# EAGLE design esp8266Board (EAGLE 8.7.0)
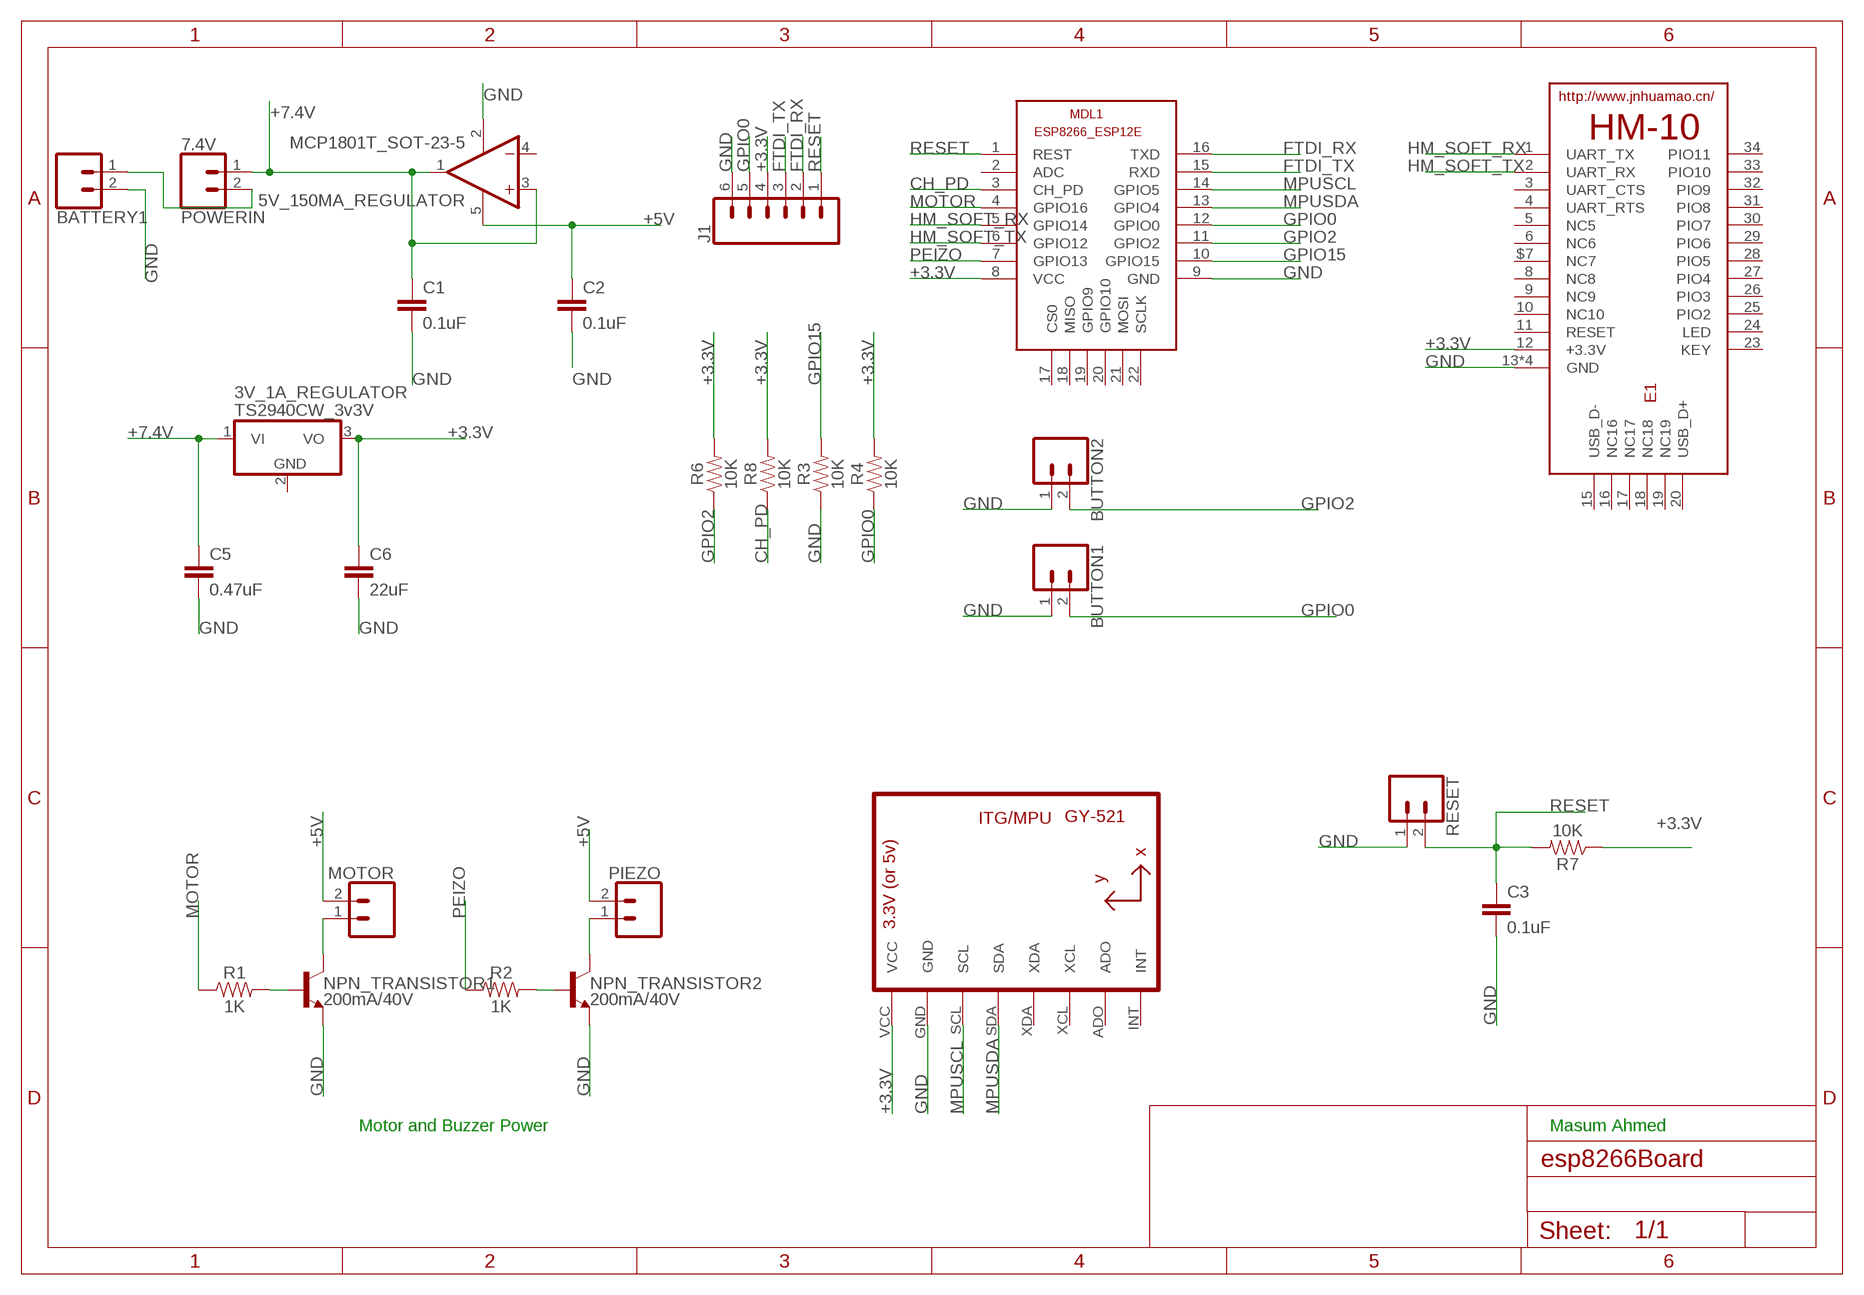
[diagram p0: schematic, sheet 1]

## Parts
3V_1A_REGULATOR  TS2940CW_3v3V  MCP1703DB  [SOT223]
5V_150MA_REGULATOR  MCP1801T_SOT-23-5  MCP601OT  [SOT23-5]
BATTERY1  CONN_02  [1X02]
BUTTON1  CONN_02  [1X02]
BUTTON2  CONN_02  [1X02]
C1  0.1uF  1.0UF-0805-25V-10%  [0805]
C2  0.1uF  1.0UF-0805-25V-10%  [0805]
C3  0.1uF  1.0UF-0805-25V-10%  [0805]
C5  0.47uF  0.1UF-KIT-EZ-50V-20%  [CAP-PTH-SMALL-KIT]
C6  22uF  0.1UF-KIT-EZ-50V-20%  [CAP-PTH-SMALL-KIT]
E1  HM-10-BOARD  [26.9X13X2.2_BOARD]
J1  CONN_06SILK_FEMALE_PTH  [1X06]
MDL1  ESP8266-12EESP8266-ESP12E  [ESP8266-ESP12E]
MOTOR  CONN_02  [1X02]
NPN_TRANSISTOR1  200mA/40V  TRANS_NPN-2N3904  [TO-92]
NPN_TRANSISTOR2  200mA/40V  TRANS_NPN-2N3904  [TO-92]
PIEZO  CONN_02  [1X02]
POWERIN  7.4V  CONN_02  [1X02]
R1  1K  0.22OHM-0805-1/4W-1%  [0805]
R2  1K  0.22OHM-0805-1/4W-1%  [0805]
R3  10K  0.22OHM-0805-1/4W-1%  [0805]
R4  10K  0.22OHM-0805-1/4W-1%  [0805]
R6  10K  0.22OHM-0805-1/4W-1%  [0805]
R7  10K  0.22OHM-0805-1/4W-1%  [0805]
R8  10K  0.22OHM-0805-1/4W-1%  [0805]
RESET  CONN_02  [1X02]
U1  GY-521MPU6050  [GY-521]

## Nets
+3.3V: 3V_1A_REGULATOR.3(VO) C6.1 E1.12(+3.3V) J1.4 MDL1.8(VCC) R4.2 R6.2 R7.1 R8.2 U1.VCC
+5V: 5V_150MA_REGULATOR.5(V+) C2.1 MOTOR.2 PIEZO.2
+7.4V: 3V_1A_REGULATOR.1(VI) 5V_150MA_REGULATOR.1(OUT) 5V_150MA_REGULATOR.3(+IN) C1.1 C5.1 POWERIN.1
CH_PD: MDL1.3(CH_PD) R8.1
FTDI_RX: J1.2 MDL1.16(TXD)
FTDI_TX: J1.3 MDL1.15(RXD)
GND: 5V_150MA_REGULATOR.2(V-) BATTERY1.2 BUTTON1.1 BUTTON2.1 C1.2 C2.2 C3.2 C5.2 C6.2 E1.13(GND) E1.14(GND) E1.21(GND) E1.22(GND) J1.6 MDL1.9(GND) NPN_TRANSISTOR1.1(E) NPN_TRANSISTOR2.1(E) R3.1 RESET.1 U1.GND
GPIO0: BUTTON1.2 J1.5 MDL1.12(GPIO0) R4.1
GPIO2: BUTTON2.2 MDL1.11(GPIO2) R6.1
GPIO15: MDL1.10(GPIO15) R3.2
HM_SOFT_RX: E1.1(UART_TX) MDL1.5(GPIO14)
HM_SOFT_TX: E1.2(UART_RX) MDL1.6(GPIO12)
MOTOR: MDL1.4(GPIO16) R1.1
MPUSCL: MDL1.14(GPIO5) U1.SCL
MPUSDA: MDL1.13(GPIO4) U1.SDA
N$1: BATTERY1.1 POWERIN.2
N$4: NPN_TRANSISTOR2.2(B) R2.2
N$5: NPN_TRANSISTOR1.2(B) R1.2
N$6: NPN_TRANSISTOR2.3(C) PIEZO.1
N$9: MOTOR.1 NPN_TRANSISTOR1.3(C)
PEIZO: MDL1.7(GPIO13) R2.1
RESET: C3.1 J1.1 MDL1.1(REST) R7.2 RESET.2
Unconnected: 3V_1A_REGULATOR.2(GND) 5V_150MA_REGULATOR.4(-IN) E1.3(UART_CTS) E1.4(UART_RTS) E1.5(NC5) E1.6(NC6) E1.8(NC8) E1.9(NC9) E1.10(NC10) E1.11(RESET) E1.15(USB_D-) E1.16(NC16) E1.17(NC17) E1.18(NC18) E1.19(NC19) E1.20(USB_D+) E1.23(KEY) E1.24(LED) E1.25(PIO2) E1.26(PIO3) E1.27(PIO4) E1.28(PIO5) E1.29(PIO6) E1.30(PIO7) E1.31(PIO8) E1.32(PIO9) E1.33(PIO10) E1.34(PIO11) E1.$7(NC7) MDL1.2(ADC) MDL1.17(CS0) MDL1.18(MISO) MDL1.19(GPIO9) MDL1.20(GPIO10) MDL1.21(MOSI) MDL1.22(SCLK) U1.ADO U1.INT U1.XCL U1.XDA

## Notes on the sheet
- Motor and Buzzer Power | Masum Ahmed

## Library data of the parts
3V_1A_REGULATOR = linear:MCP1703: 250 mA, 16V, Low Quiescent Current LDO Regulator Source: http://ww1.microchip.com/downloads/en/DeviceDoc/22049b.pdf
5V_150MA_REGULATOR = linear:MCP601: Single Op Amp 2.7V to 6.0V Single Supply CMOS Source: http://ww1.microchip.com/downloads/en/DeviceDoc/21314g.pdf
BATTERY1 BUTTON1 BUTTON2 MOTOR PIEZO POWERIN RESET = SparkFun-Connectors:CONN_02: Multi connection point. Often used as Generic Header-pin footprint for 0.1 inch spaced/style header connections On any of the 0.1 inch spaced packages, you can populate with these: Break Away Headers - Straight <https://www.sparkfun.com/products/116> (PRT-00116) Break Away Male Headers - Right Angle <https://www.sparkfun.com/products/553> (PRT-00553) Female Headers <https://www.sparkfun.com/products/115> (PRT-00115) Break Away Headers - Machine Pin <https://www.sparkfun.com/products/117> (PRT-00117) Break Away Female Headers - Swiss Machine Pin <https://www.sparkfun.com/products/743> (PRT-00743) For SCREWTERMINALS and SPRING TERMINALS visit here: Screw Terimnals on SparkFun.com <https://www.sparkfun.com/search/results?term=Screw+Terminals> (5mm/3.5mm/2.54mm spacing) This device is also useful as a general connection point to wire up your design to another part of your project. Our various solder wires solder well into these plated through hole pads. Hook-Up Wire - Assortment (Stranded, 22 AWG) <https://www.sparkfun.com/products/11375> (PRT-11375) Hook-Up Wire - Assortment (Solid Core, 22 AWG) <https://www.sparkfun.com/products/11367> (PRT-11367) View the entire wire category on our website here <https://www.sparkfun.com/categories/141> Special notes: Molex polarized connector foot print use with: PRT-08233 with associated crimp pins and housings. 2.54_SCREWTERM for use with PRT-10571. 3.5mm Screw Terminal footprints for PRT-08084 5mm Screw Terminal footprints for use with PRT-08432
C1-C3 = Capacitors:1.0UF: 1�F ceramic capacitors A capacitor is a passive two-terminal electrical component used to store electrical energy temporarily in an electric field.; PROD_ID: CAP-08064; VALUE: 1.0uF
C5 C6 = SparkFun-Capacitors:0.1UF: 0.1µF ceramic capacitors A capacitor is a passive two-terminal electrical component used to store electrical energy temporarily in an electric field.; PROD_ID: CAP-08370; VALUE: 0.1uF
E1 = hm10:HM-10: HM Bluetooth module use TI CC2540 or CC2541, Master and slave roles in one, transmission version and remote control version and PIO state acquisition functions in one, Support the AT command modify module parameters, Convenient and flexible.
J1 = SparkFun-Connectors:CONN_06: Multi connection point. Often used as Generic Header-pin footprint for 0.1 inch spaced/style header connections On any of the 0.1 inch spaced packages, you can populate with these: Break Away Headers - Straight <https://www.sparkfun.com/products/116> (PRT-00116) Break Away Male Headers - Right Angle <https://www.sparkfun.com/products/553> (PRT-00553) Female Headers <https://www.sparkfun.com/products/115> (PRT-00115) Break Away Headers - Machine Pin <https://www.sparkfun.com/products/117> (PRT-00117) Break Away Female Headers - Swiss Machine Pin <https://www.sparkfun.com/products/743> (PRT-00743) Arduino Stackable Header - 6 Pin <https://www.sparkfun.com/products/9280> (PRT-09280) For SCREWTERMINALS and SPRING TERMINALS visit here: Screw Terimnals on SparkFun.com <https://www.sparkfun.com/search/results?term=Screw+Terminals> (5mm/3.5mm/2.54mm spacing) This device is also useful as a general connection point to wire up your design to another part of your project. Our various solder wires solder well into these plated through hole pads. Hook-Up Wire - Assortment (Stranded, 22 AWG) <https://www.sparkfun.com/products/11375> (PRT-11375) Hook-Up Wire - Assortment (Solid Core, 22 AWG) <https://www.sparkfun.com/products/11367> (PRT-11367) View the entire wire category on our website here <https://www.sparkfun.com/categories/141>; PROD_ID: CONN-08437
MDL1 = esp826612e:ESP8266-12E: ESP8266-12E with additional I/O and GPIO04/05 corrected The author cannot warrant that this library is free from error or will meet your specific requirements. Created by PuceBaboon.com. Komagane, Nagano, JAPAN
NPN_TRANSISTOR1 NPN_TRANSISTOR2 = SparkFun-DiscreteSemi:TRANS_NPN: NPN transistor Current controlled devices typically used to amplify current or used as a switch. BC547 - COM-08928 <http://www.sparkfun.com/products/8928> (TO-92 45V 100mA) (1.Collector 2.Base 3.Emitter) 2N3904 - COM-00521 <http://www.sparkfun.com/products/521> (TO-92 40V 200mA) (1.Emitter 2.Base 3.Collector) P2N2222A - COM-12852 <http://www.sparkfun.com/products/12852> (TO-92 40V 600mA) (1.Collector 2.Base 3.Emitter); PROD_ID: TRANS-08447
R1-R4 R6-R8 = SparkFun-Resistors:0.22OHM: 0.22Ω resistor A resistor is a passive two-terminal electrical component that implements electrical resistance as a circuit element. Resistors act to reduce current flow, and, at the same time, act to lower voltage levels within circuits. - Wikipedia; PROD_ID: RES-09883; VALUE: 0.22
U1 = mpu6050:GY-521

## Board
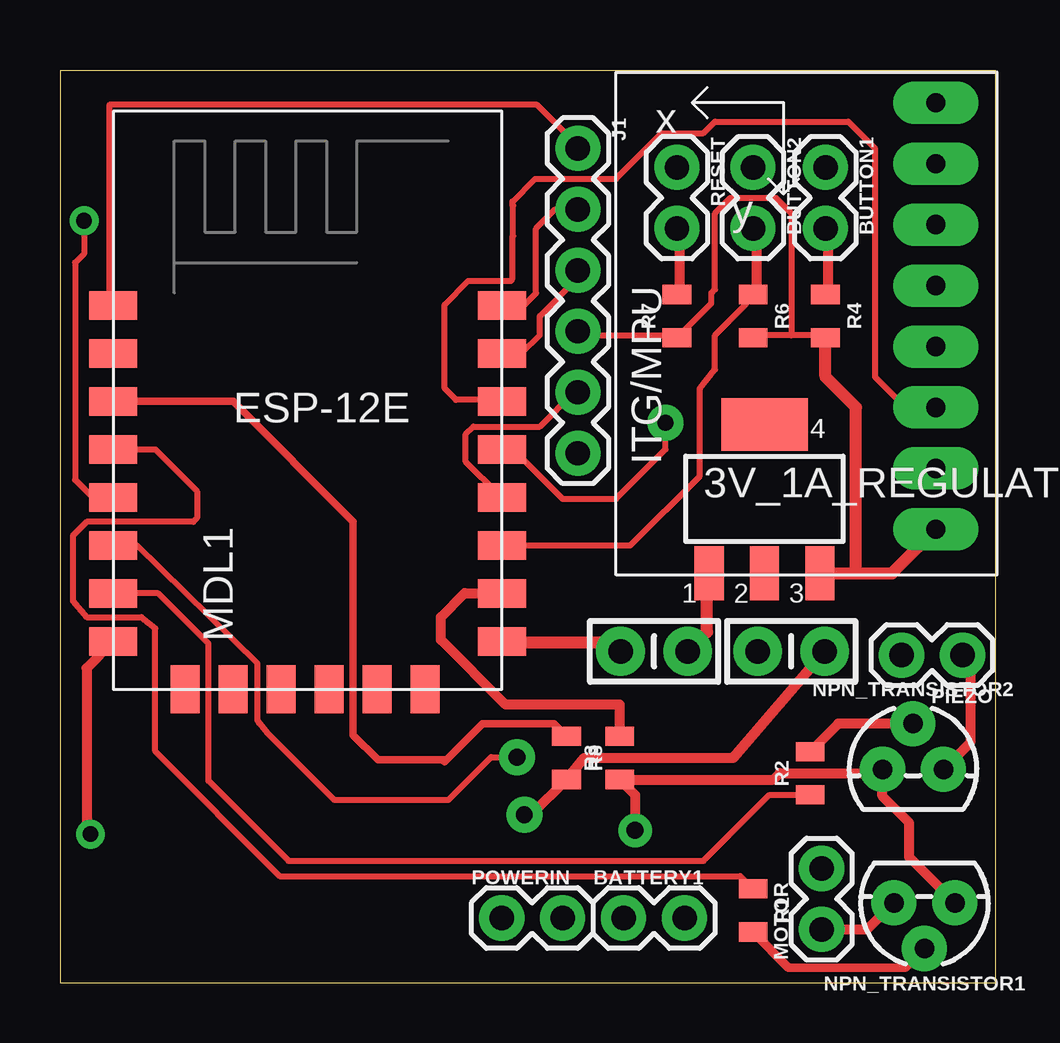
[diagram p1: board, top side]
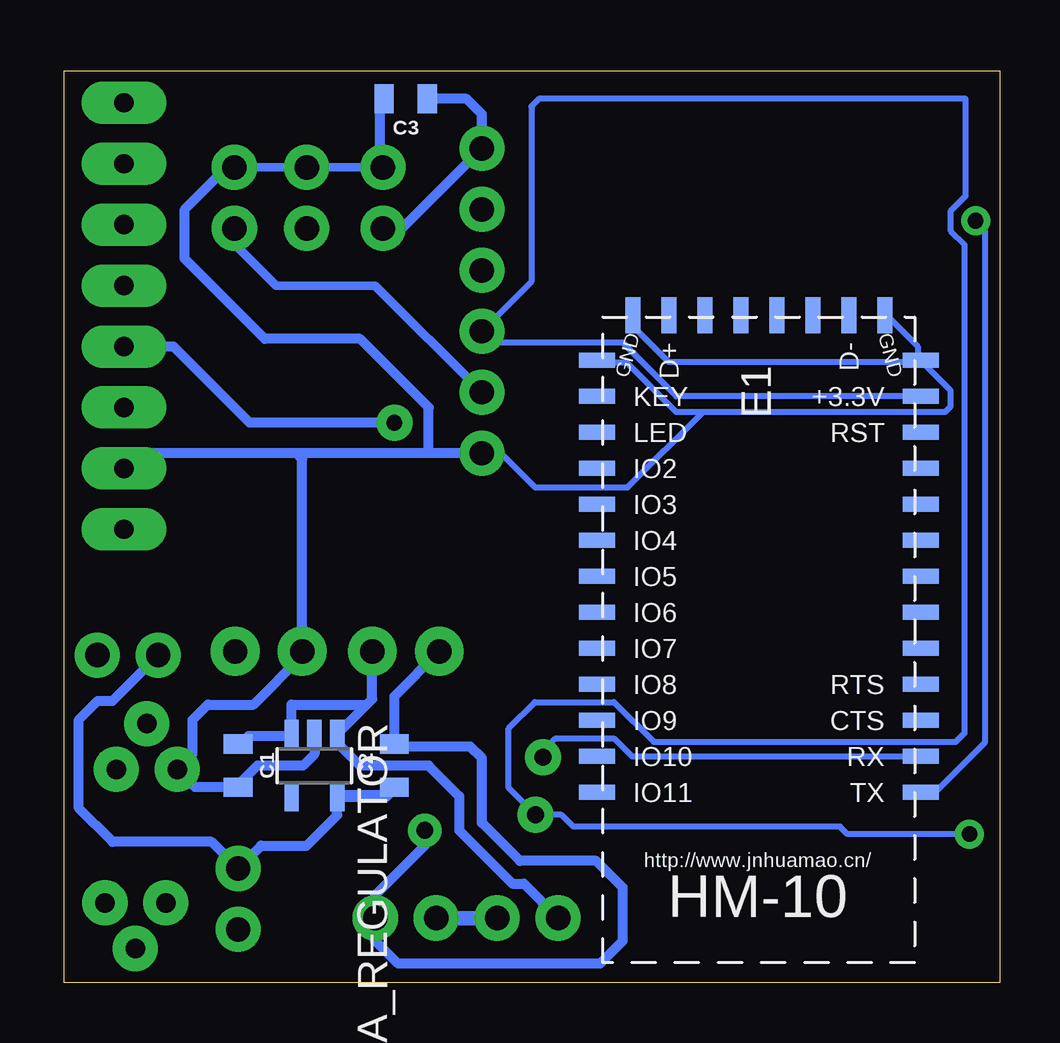
[diagram p2: board, bottom side, seen from below]

Size 39 x 38 mm. Coordinates in mm from the lower left corner, seen from the top.
Outline: 0,0 39,0 39,38 0,38 0,0
Copper layers (1*16): Top 0.035mm / dielectric 1.5mm / Bottom 0.035mm
Design rules "watch PCB rules *": minimum track width 10mil, minimum drill 0.5mm, track to track 8mil, track to pad 6mil, pad to pad 8mil, via to via 12mil, smd to smd 8mil, copper to edge 16mil, drill to drill 6mil, minimum pad ring 10mil, minimum via ring 8mil, stop-mask expansion 4mil, vias tented up to drill 0mil, thermal gap 12mil
vRestrict: area 1.1,12.1 to 19.5,30.8; area 2.4,0.3 to 17.8,12.2

### Footprints (pad centres in the part's own frame; a part is rotated, then mirrored left to right if it is on the bottom)
SOT223 = smd 1.219 x 2.235: 1 -2.311,-3.099; 2 0,-3.099; 3 2.311,-3.099 | smd 3.6 x 2.2: 4 0,3.099
SOT23-5 = smd 0.6 x 1.2: 1 -0.95,-1.306; 2 0,-1.306; 3 0.95,-1.306; 4 0.95,1.306; 5 -0.95,1.306
1X02 = drill 1.016 pad 1.88: 1 0,0; 2 2.54,0
0805 = smd 0.8 x 1.2: 1 -0.9,0; 2 0.9,0
CAP-PTH-SMALL-KIT = drill 1.016 pad 2.032: 1 -1.397,0; 2 1.397,0
26.9X13X2.2_BOARD = smd 1.5 x 0.635: 1 -7.5,0; 2 -7.5,-1.5; 3 -7.5,-3; 4 -7.5,-4.5; 5 -7.5,-6; 6 -7.5,-7.5; 8 -7.5,-10.5; 9 -7.5,-12; 10 -7.5,-13.5; 11 -7.5,-15; 12 -7.5,-16.5; 13 -7.5,-18; 22 6,-18; 23 6,-16.5; 24 6,-15; 25 6,-13.5; 26 6,-12; 27 6,-10.5; 28 6,-9; 29 6,-7.5; 30 6,-6; 31 6,-4.5; 32 6,-3; 33 6,-1.5; 34 6,0; $7 -7.5,-9 | smd 0.635 x 1.5: 14 -6,-19.875; 15 -4.5,-19.875; 16 -3,-19.875; 17 -1.5,-19.875; 18 0,-19.875; 19 1.5,-19.875; 20 3,-19.875; 21 4.5,-19.875
1X06 = drill 1.016 pad 1.88: 1 0,0; 2 2.54,0; 3 5.08,0; 4 7.62,0; 5 10.16,0; 6 12.7,0
ESP8266-ESP12E = smd 2 x 1.2: 1 -7.62,5.84; 2 -7.62,3.84; 3 -7.62,1.84; 4 -7.62,-0.16; 5 -7.62,-2.16; 6 -7.62,-4.16; 7 -7.62,-6.16; 8 -7.62,-8.16; 9 8.58,-8.16; 10 8.58,-6.16; 11 8.58,-4.16; 12 8.58,-2.16; 13 8.58,-0.16; 14 8.58,1.84; 15 8.58,3.84; 16 8.58,5.84 | smd 1.2 x 2: 17 -4.62,-10.16; 18 -2.62,-10.16; 19 -0.62,-10.16; 20 1.38,-10.16; 21 3.38,-10.16; 22 5.38,-10.16
TO-92 = drill 0.813 pad 1.88: 1 -1.27,0; 2 0,1.905; 3 1.27,0
GY-521 = drill 0.8 pad 1.778 long: ADO -8.89,-6.35; GND -8.89,6.35; INT -8.89,-8.89; SCL -8.89,3.81; SDA -8.89,1.27; VCC -8.89,8.89; XCL -8.89,-3.81; XDA -8.89,-1.27

### Placement (x,y rotation side)
3V_1A_REGULATOR  29.37,20.16 0 top
5V_150MA_REGULATOR  28.57,9.05 180 bottom
BATTERY1  23.5,2.7 0 top
BUTTON1  31.91,33.97 270 top
BUTTON2  28.89,33.97 270 top
C1  31.75,9.05 270 bottom
C2  25.24,9.05 90 bottom
C3  24.77,36.83 180 bottom
C5  24.77,13.81 180 top
C6  30.48,13.81 180 top
E1  10.79,7.94 180 bottom
J1  21.59,34.77 270 top
MDL1  9.84,22.38 0 top
MOTOR  31.75,2.22 90 top
NPN_TRANSISTOR1  36.04,3.33 180 top
NPN_TRANSISTOR2  35.56,8.89 0 top
PIEZO  37.62,13.65 180 top
POWERIN  18.41,2.7 0 top
R1  28.89,3.02 270 top
R2  31.27,8.73 90 top
R3  23.34,9.37 90 top
R4  31.91,27.78 270 top
R6  28.89,27.78 270 top
R7  25.72,27.78 90 top
R8  21.11,9.37 270 top
RESET  25.72,33.97 270 top
U1  27.62,27.78 180 top

### Tracks (layer width: path | path; a pad name or v marks a point on that pad's centre or on a via)
+3.3V  (via drill 0.65 pad 1.2, 0.7 pad 1.5)
  Top 0.254: J1.4 21.72,26.98 25.6,26.98 R7.1 27.15,28.31 27.15,28.73 27.3,28.89 27.3,32.07 27.94,32.7 29.84,32.7 30.48,32.07 30.48,26.98 | 30.48,26.98 31.77,26.98 R4.2 31.77,26.75 | 30.48,26.98 29.03,26.98 R6.2 | 31.77,17.14 3V_1A_REGULATOR.3 | 36.35,18.97 U1.VCC
  Top 0.406: C6.1 28.07,9.37 21.86,9.37 R8.2 19.64,7 v19.36,7 | MDL1.8 1.11,13.11 1.11,6.35 v1.27,6.19
  Top 0.508: 3V_1A_REGULATOR.3 33.18,17.06 | 33.18,17.06 34.68,17.06 U1.VCC | 33.18,17.06 33.18,23.97 31.91,25.24 R4.2
  Bottom 0.254: E1.12 13.48,24.44 15.72,26.67 21.11,26.67 J1.4 19.53,29.21 19.53,36.51 19.21,36.83 1.43,36.83 1.43,32.79 2.04,32.18 2.04,31.32 1.46,30.75 1.46,10.41 1.84,10.03 14.43,10.03 16.09,11.69 19.38,11.69 20.48,10.6 20.48,8.12 v19.36,7 18.27,7 17.78,6.51 6.67,6.51 6.35,6.19 v1.27,6.19
+5V
  Bottom 0.254: 27.43,7.77 5V_150MA_REGULATOR.5 | 25.38,8 C2.1
  Bottom 0.406: 5V_150MA_REGULATOR.5 27.62,6.98 28.89,5.71 30.8,5.71 MOTOR.2 32.86,5.87 36.99,5.87 38.39,7.28 38.39,10.95 37.6,11.75 36.99,11.75 PIEZO.2
  Bottom 0.508: 27.43,7.77 25.6,7.77 25.38,8
+7.4V
  Top 0.254: 26.98,16.92 3V_1A_REGULATOR.1
  Top 0.508: C5.1 26.98,14.62 26.98,16.92
  Bottom 0.254: 29.72,10.29 5V_150MA_REGULATOR.3 29.49,10.52 29.49,10.74 | 31.55,10.06 C1.1 | 27.43,10.52 5V_150MA_REGULATOR.1 | 27.43,10.29 5V_150MA_REGULATOR.1 | 27.62,10 5V_150MA_REGULATOR.1
  Bottom 0.406: 29.72,10.29 31.32,10.29 31.55,10.06 | 5V_150MA_REGULATOR.1 26.39,11.59 | C5.1 26.16,11.82 26.39,11.59 | 5V_150MA_REGULATOR.3 29.52,11.59 29.53,11.59 26.39,11.59 | 27.62,10 26.67,9.05 23.81,9.05 22.54,7.78 22.54,6.35 20.32,4.13 19.84,4.13 POWERIN.1
CH_PD
  Top 0.254: MDL1.3 2.29,24.23
  Top 0.305: R8.1 20.59,10.79 17.62,10.79 16.11,9.29 | 16.11,9.29 16.03,9.21 | 16.11,9.29 13.26,9.29 12.22,10.32 12.22,19.21 7.21,24.22 MDL1.3
FTDI_RX
  Top 0.254: MDL1.16 18.46,28.26 19.37,28.26 19.84,28.73 19.84,31.43 20.64,32.23 J1.2
FTDI_TX
  Top 0.254: 18.52,26.29 MDL1.15 19.24,26.22 20,26.99 20,27.78 21.59,29.37 J1.3
GND  (via drill 0.7 pad 1.4)
  Top 0.254: 36.35,21.49 U1.GND | 32,33.83 BUTTON1.1 | 18.52,14.17 MDL1.9
  Top 0.406: v23.97,6.35 23.97,7.83 R3.1 29.74,8.47 30,8.73 34.29,8.73 | NPN_TRANSISTOR1.1 35.4,5.24 35.4,6.67 34.29,7.78 34.29,8.73 | 34.29,8.73 NPN_TRANSISTOR2.1
  Top 0.508: C5.2 23.01,14.17 18.52,14.17
  Bottom 0.254: 25.83,34.06 RESET.1 | 35.89,21.95 36.35,21.49 U1.GND | 21.72,21.95 J1.6 20.8,22.07 19.37,20.64 15.52,20.64 12.38,23.77 | E1.13 3.43,26.06 3.43,26.52 4.57,27.66 E1.14 4.8,27.66 | 12.38,23.77 2.29,23.77 2.06,24 2.06,24.69 3.2,25.83 E1.13 | 12.38,23.77 13.49,23.77 15.54,25.83 16.69,25.83 E1.22 | 31.77,8.23 C1.2 | 29.21,21.95 29.33,22.07 29.53,22.07 | 25.14,9.84 C2.2 | E1.21 15.29,27.36 13.81,25.88 3.36,25.88 E1.13
  Bottom 0.356: 32.23,33.97 BUTTON1.1 BUTTON2.1 RESET.1
  Bottom 0.406: 25.83,34.06 25.83,36.58 C3.2 | C2.2 25.24,11.94 C5.2 | C1.2 33.55,8.15 NPN_TRANSISTOR2.1 33.66,9.53 33.66,10.95 33.02,11.59 31.11,11.59 29.08,13.62 C6.2 29.08,21.82 29.21,21.95 | J1.6 23.81,22.07 | 23.81,22.07 29.53,22.07 35.88,22.07 U1.GND | 23.81,22.07 23.81,23.97 26.67,26.83 30.64,26.83 33.97,30.16 33.97,32.23 32.23,33.97 | 25.14,9.84 22.07,9.84 21.59,9.37 21.59,6.67 20,5.08 16.83,5.08 15.72,3.97 15.72,1.75 16.67,0.79 25.08,0.79 26.04,1.75 BATTERY1.2 26.04,3.65 23.97,5.71 v23.97,6.35 | 5V_150MA_REGULATOR.2 28.57,9.53 29.05,9.05 30.96,9.05 31.77,8.23
GPIO0
  Top 0.254: 32,28.8 R4.1 | 32,31.32 BUTTON1.2 | MDL1.12 18.29,20.34 16.92,21.72 16.92,22.86 17.23,23.18 20,23.18 21.43,24.61 J1.5
  Top 0.406: 32,31.32 32,28.8
  Bottom 0.254: 31.77,31.32 BUTTON1.2 31.91,31.27 | 21.72,24.69 J1.5
  Bottom 0.356: J1.5 26.04,29.05 30.16,29.05 31.91,30.8 31.91,31.27
GPIO2
  Top 0.254: 29.03,28.8 R6.1 28.57,28.68 28.57,28.26 27.3,26.99 27.3,25.56 26.67,24.77 26.67,21.11 23.78,18.22 MDL1.11 | 29.03,31.32 BUTTON2.2
  Top 0.406: 29.03,31.32 29.03,28.8
GPIO15
  Top 0.254: 18.29,16.23 MDL1.10
  Top 0.406: R3.2 23.34,11.59 18.57,11.59 15.88,14.29 15.88,15.24 16.87,16.23 18.29,16.23
HM_SOFT_RX  (via drill 0.65 pad 1.2)
  Top 0.254: v1.01,31.75 1.01,30.38 0.64,30 0.64,20.95 1.37,20.22 MDL1.5
  Bottom 0.254: v1.01,31.75 0.64,31.38 0.64,10 2.7,7.94 E1.1
HM_SOFT_TX  (via drill 0.7 pad 1.5)
  Top 0.254: 8.23,10.92 8.23,13.31 3.22,18.22 MDL1.6 | 8.29,10.83 8.23,10.92 | 8.23,10.92 8.65,10.4 11.43,7.62 16.19,7.62 17.97,9.4 v19.05,9.4
  Bottom 0.254: E1.2 15.33,9.44 16.05,10.16 18.54,10.16 19.05,9.65 v19.05,9.4
MOTOR
  Top 0.254: 2.06,22.17 MDL1.4 3.97,22.22 5.71,20.48 5.71,19.37 5.56,19.21 1.11,19.21 0.53,18.63 0.53,15.92 1.11,15.24 3.39,15.24 3.97,14.76 3.97,9.64 9.16,4.45 28.36,4.45 R1.1
MPUSCL
  Top 0.254: MDL1.14 18.36,24.29 16.51,24.29 16.03,24.77 16.03,28.26 17.02,29.24 18.79,29.24 18.86,29.32 18.86,31.08 18.89,31.11 18.89,32.38 18.86,32.42 18.86,32.54 19.81,33.5 23.18,33.5 23.26,33.58 25.08,35.4 26.83,35.4 27.3,35.88 32.86,35.88 33.97,34.77 33.97,25.24 35.24,23.97 U1.SCL
MPUSDA  (via drill 0.65 pad 1.5)
  Top 0.254: MDL1.13 18.89,22.22 20.95,20.16 23.18,20.16 25.24,22.23 v25.24,23.34
  Bottom 0.406: v25.24,23.34 31.27,23.34 34.45,26.51 U1.SDA
N$1
  Bottom 0.61: POWERIN.2 BATTERY1.1
N$4
  Top 0.406: NPN_TRANSISTOR2.2 32.44,10.79 R2.2
N$5
  Top 0.254: 35.82,1.43 NPN_TRANSISTOR1.2
  Top 0.356: R1.2 30.37,0.64 35.24,0.64 NPN_TRANSISTOR1.2
N$6
  Top 0.406: NPN_TRANSISTOR2.3 37.94,10 37.94,13.34 PIEZO.1
N$9
  Top 0.406: NPN_TRANSISTOR1.3 33.66,2.22 MOTOR.1
PEIZO
  Top 0.254: MDL1.7 4.1,16.22 6.19,14.13 6.19,8.41 9.53,5.08 26.83,5.08 29.58,7.83 R2.1
RESET
  Top 0.254: 25.83,28.8 R7.2 | 25.83,31.32 RESET.2 | MDL1.1 2.06,28.35 2.06,36.58 19.89,36.58 21.49,34.98 J1.1
  Top 0.406: 25.83,31.32 25.83,28.8
  Bottom 0.406: C3.1 22.23,36.83 21.59,36.2 J1.1 24.92,31.43 RESET.2